# Altium schematic sheet CM108B.SchDoc
size A4
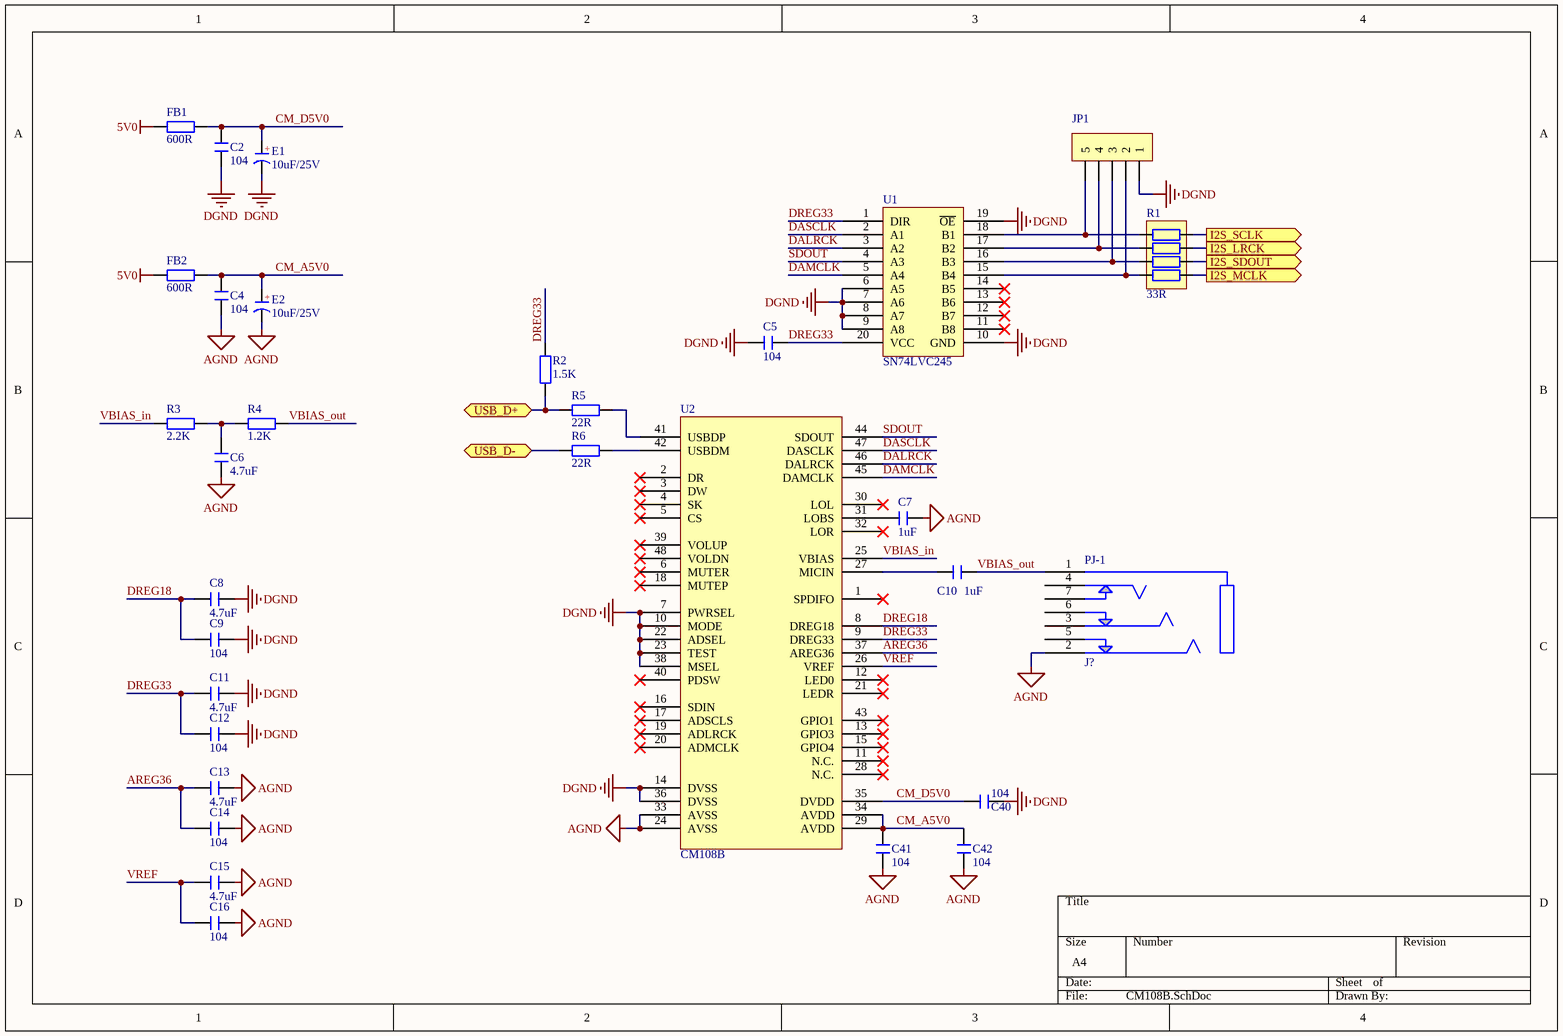
[diagram p0: CM108B.SchDoc]

## Parts
C2  104  [C 0603_L]
C4  104  [C 0603_L]
C5  104  [C 0603_L]
C6  4.7uF  [C 0603_L]
C7  1uF  [C 0603_L]
C8  4.7uF  [C 0603_L]
C9  104  [C 0603_L]
C10  1uF  [WIMA 1uF]
C11  4.7uF  [C 0603_L]
C12  104  [C 0603_L]
C13  4.7uF  [C 0603_L]
C14  104  [C 0603_L]
C15  4.7uF  [C 0603_L]
C16  104  [C 0603_L]
C40  104  [C 0603_L]
C41  104  [C 0603_L]
C42  104  [C 0603_L]
E1  10uF/25V  [CD A(3216)]
E2  10uF/25V  [CD A(3216)]
FB1  600R  [R 0805_L]
FB2  600R  [R 0805_L]
JP1  HDR-1X5  [HDR2.54-LI-5P]  (value not drawn)
PJ-1  J?  [PJ-393-7A]
R1  33R  [RCA-8P4R-0402]
R2  1.5K  [R 0603_L]
R3  2.2K  [R 0603_L]
R4  1.2K  [R 0603_L]
R5  22R  [R 0603_L]
R6  22R  [R 0603_L]
U1  SN74LVC245  [TSSOP20_N]
U2  CM108B  [LQFP48_N]

## Ports
I2S_LRCK (out), I2S_MCLK (out), I2S_SCLK (out), I2S_SDOUT (out), USB_D+, USB_D-

## Nets
5V0: FB1.1 FB2.1
AGND: C4.1 C6.2 C7.1 C13.1 C14.2 C15.1 C16.2 C41.2 C42.1 E2.2(K) PJ-1.2 U2.24(AVSS) U2.33(AVSS)
DGND: C2.1 C5.1 C8.1 C9.2 C11.1 C12.2 C40.2 E1.2(K) JP1.1 U1.6(A5) U1.7(A6) U1.8(A7) U1.9(A8) U1.10(GND) U1.19(~{OE}) U2.7(PWRSEL) U2.10(MODE) U2.14(DVSS) U2.22(ADSEL) U2.23(TEST) U2.36(DVSS) U2.38(MSEL)
AREG36: C13.2 C14.1 U2.37(AREG36)
CM_A5V0: C4.2 C41.1 C42.2 E2.1(A) FB2.2 U2.29(AVDD) U2.34(AVDD)
CM_D5V0: C2.2 C40.1 E1.1(A) FB1.2 U2.35(DVDD)
DALRCK: U1.3(A2) U2.46(DALRCK)
DAMCLK: U1.5(A4) U2.45(DAMCLK)
DASCLK: U1.2(A1) U2.47(DASCLK)
DREG18: C8.2 C9.1 U2.8(DREG18)
DREG33: C5.2 C11.2 C12.1 R2.2 U1.1(DIR) U1.20(VCC) U2.9(DREG33)
I2S_LRCK: R1.3 ; port I2S_LRCK
I2S_MCLK: R1.1 ; port I2S_MCLK
I2S_SCLK: R1.4 ; port I2S_SCLK
I2S_SDOUT: R1.2 ; port I2S_SDOUT
SDOUT: U1.4(A3) U2.44(SDOUT)
USB_D+: R2.1 R5.1 ; port USB_D+
USB_D-: R6.1 ; port USB_D-
VBIAS_in: R3.1 U2.25(VBIAS)
VBIAS_out: C10.2 PJ-1.1 R4.2
VREF: C15.2 C16.1 U2.26(VREF)
NetC6_1: C6.1 R3.2 R4.1
NetC7_2: C7.2 U2.31(LOBS)
NetC10_1: C10.1 U2.27(MICIN)
NetJP1_2: JP1.2 R1.8 U1.15(B4)
NetJP1_3: JP1.3 R1.7 U1.16(B3)
NetJP1_4: JP1.4 R1.6 U1.17(B2)
NetJP1_5: JP1.5 R1.5 U1.18(B1)
NetR5_2: R5.2 U2.41(USBDP)
NetR6_2: R6.2 U2.42(USBDM)

Not connected (* = marked no-connect by the designer): PJ-1 3 4 5 6 7; U1 11(B8)* 12(B7)* 13(B6)* 14(B5)*; U2 1(SPDIFO)* 2(DR)* 3(DW)* 4(SK)* 5(CS)* 6(MUTER)* 11(N.C.)* 12(LED0)* 13(GPIO3)* 15(GPIO4)* 16(SDIN)* 17(ADSCLS)* 18(MUTEP)* 19(ADLRCK)* 20(ADMCLK)* 21(LEDR)* 28(N.C.)* 30(LOL)* 32(LOR)* 39(VOLUP)* 40(PDSW)* 43(GPIO1)* 48(VOLDN)*

## Notes on the sheet
- (in symbol CT) +

## Library data of the parts
C2 C4-C16 C40-C42 = C: 贴片电容; BOM名称: 无极性贴片电容; 优秀评价可免费更新: 联系淘宝ID：黄晶宝石，获取更新版封装库; 卖家免费技术支持，联系售后: 唯一出售店铺网址https://shop463601444.taobao.com; 本封装库来自淘宝卖家 ID：黄晶宝石: 其他店铺购入均为盗版，请立即申请退款
E1 E2 = CT: 贴片钽电容; 优秀评价可免费更新: 联系淘宝ID：黄晶宝石，获取更新版封装库; 卖家免费技术支持，联系售后: 唯一出售店铺网址https://shop463601444.taobao.com; 本封装库来自淘宝卖家 ID：黄晶宝石: 其他店铺购入均为盗版，请立即申请退款; BOM名称: 贴片钽电容
FB1 FB2 R2-R6 = R: 贴片电阻; 优秀评价可免费更新: 联系淘宝ID：黄晶宝石，获取更新版封装库; 卖家免费技术支持，联系售后: 唯一出售店铺网址https://shop463601444.taobao.com; 本封装库来自淘宝卖家 ID：黄晶宝石: 其他店铺购入均为盗版，请立即申请退款; BOM名称: 贴片电阻
JP1 = Header 5: 5P接插件; 版权归属: 封装库来自淘宝 ID：黄晶宝石; 优秀评价可免费更新: 联系淘宝ID：黄晶宝石，获取更新版封装库; 卖家免费技术支持，联系售后: 唯一出售店铺网址https://shop463601444.taobao.com; BOM名称: 5P接插件
PJ-1 = PJ-393-7: 3.5mm 4段 耳机插座
R1 = R-8P4R: 贴片排阻; BOM名称: 贴片网络排阻; 优秀评价可免费更新: 联系淘宝ID：黄晶宝石，获取更新版封装库; 卖家免费技术支持，联系售后: 唯一出售店铺网址https://shop463601444.taobao.com; 本封装库来自淘宝卖家 ID：黄晶宝石: 其他店铺购入均为盗版，请立即申请退款
U2 = CM108B: USB